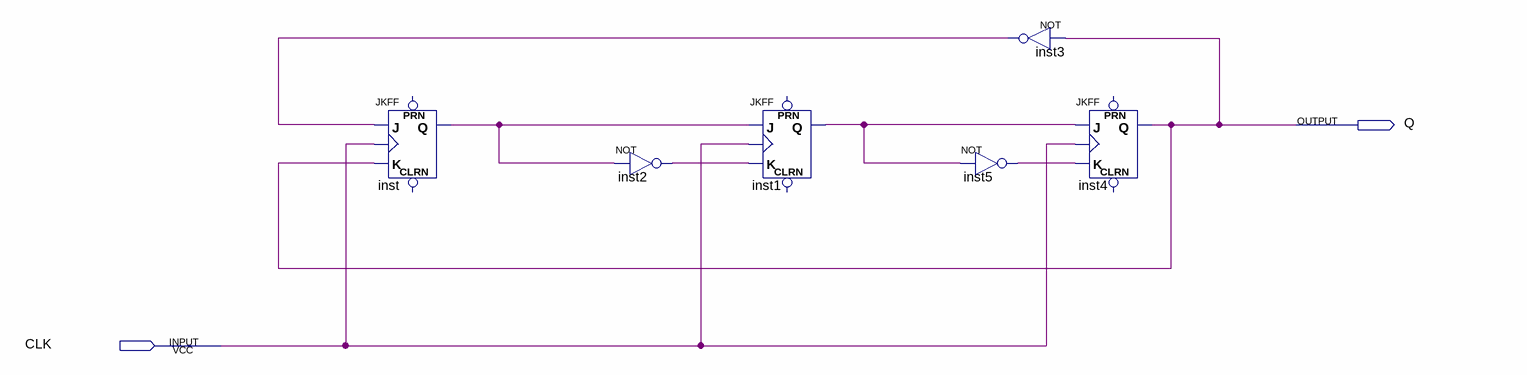
[diagram p0: schematic sheet]
// Quartus schematic SixBunshu.bdf as structural Verilog: 6 symbols, 2 pins
module SixBunshu (
  input  CLK,
  output Q
);

  wire inst1_q, inst2_out, inst3_out, inst5_out, inst_q;

  JKFF inst (.K(Q), .J(inst3_out), .CLK(CLK), .Q(inst_q));  // open: PRN, CLRN
  not inst2 (inst2_out, inst_q);
  JKFF inst1 (.K(inst2_out), .J(inst_q), .CLK(CLK), .Q(inst1_q));  // open: PRN, CLRN
  not inst5 (inst5_out, inst1_q);
  not inst3 (inst3_out, Q);
  JKFF inst4 (.K(inst5_out), .J(inst1_q), .CLK(CLK), .Q(Q));  // open: PRN, CLRN
endmodule
